# EAGLE design 2_adc (EAGLE 6.4)
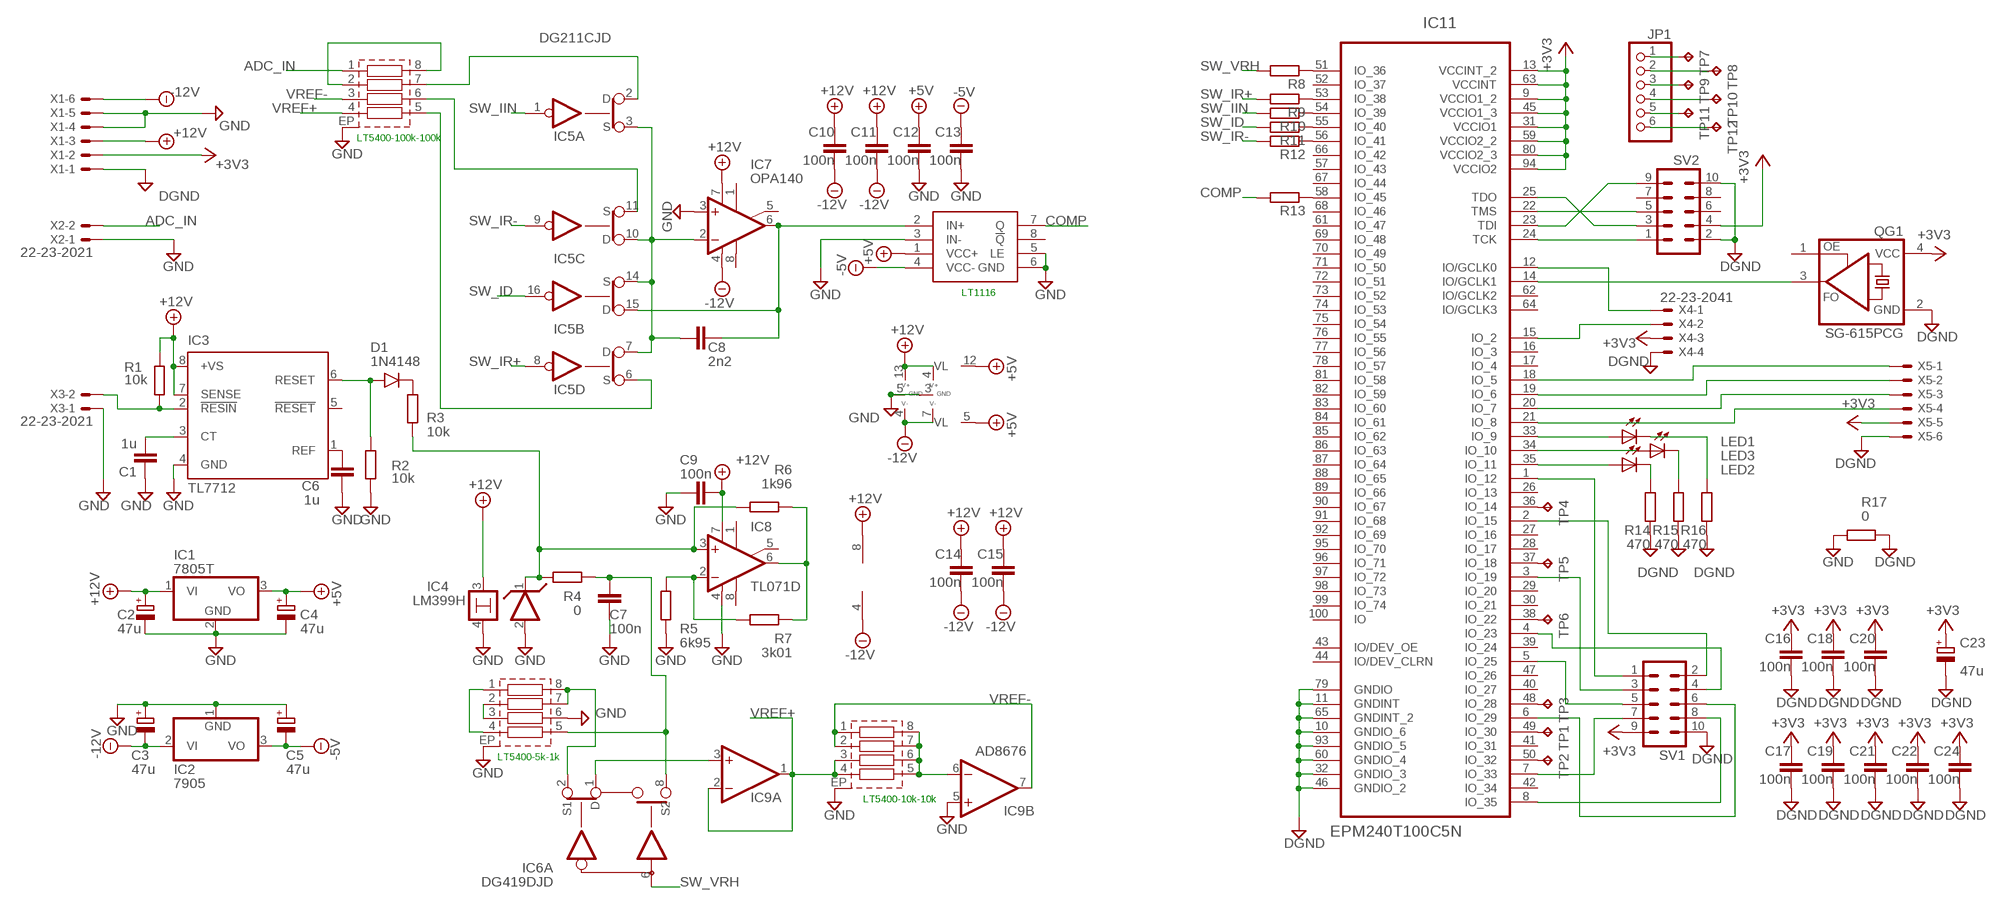
[diagram p0: schematic, sheet 1]

## Parts
C1  1u  C_0806  [R0805]
C2  47u  CPOL-EUSMCC  [SMC_C]
C3  47u  CPOL-EUSMCC  [SMC_C]
C4  47u  CPOL-EUSMCC  [SMC_C]
C5  47u  CPOL-EUSMCC  [SMC_C]
C6  1u  C_0806  [R0805]
C7  100n  C-EU050-035X075  [C050-035X075]
C8  2n2  C-EU150-054X183  [C150-054X183]
C9  100n  C_0806  [R0805]
C10  100n  C_0806  [R0805]
C11  100n  C_0806  [R0805]
C12  100n  C_0806  [R0805]
C13  100n  C_0806  [R0805]
C14  100n  C_0806  [R0805]
C15  100n  C_0806  [R0805]
C16  100n  C_0806  [R0805]
C17  100n  C_0806  [R0805]
C18  100n  C_0806  [R0805]
C19  100n  C_0806  [R0805]
C20  100n  C_0806  [R0805]
C21  100n  C_0806  [R0805]
C22  100n  C_0806  [R0805]
C23  47u  CPOL-EUSMCC  [SMC_C]
C24  100n  C_0806  [R0805]
D1  1N4148  1N4148SOD  [SOD-80]
IC1  7805T  [TO220H]
IC2  7905  7905T  [TO220H]
IC3  TL7712  TL77005AID  [SO08]
IC4  LM399H  [TO39/4]
IC5  DG211CJD  [SO16]
IC6  DG419DJD  [SO08]
IC7  OPA140  TL071D  [SO08]
IC8  TL071D  [SO08]
IC9  AD8676  TL072D  [SO08]
IC10  LT1116  [SO-08]
IC11  EPM240T100C5N  [QFP50P1600X1600X120-100N]
JP1  PINHD-1X06_2.54  [1X06]
LED1  LEDCHIPLED_0805  [CHIPLED_0805]
LED2  LEDCHIPLED_0805  [CHIPLED_0805]
LED3  LEDCHIPLED_0805  [CHIPLED_0805]
QG1  SG-615PCG  [SG-615]
R1  10k  R_0805  [R0805]
R2  10k  R_0805  [R0805]
R3  10k  R_0805  [R0805]
R4  0  R191  [R_TR191]
R5  6k95  R191  [R_TR191]
R6  1k96  R191  [R_TR191]
R7  3k01  R191  [R_TR191]
R8  R_0805  [R0805]
R9  R_0805  [R0805]
R10  R_0805  [R0805]
R11  R_0805  [R0805]
R12  R_0805  [R0805]
R13  R_0805  [R0805]
R14  470  R_0805  [R0805]
R15  470  R_0805  [R0805]
R16  470  R_0805  [R0805]
R17  0  R_0805  [R0805]
SV1  ML10  [ML10]
SV2  ML10  [ML10]
TP1  TPB1,27  [B1,27]
TP2  TPB1,27  [B1,27]
TP3  TPB1,27  [B1,27]
TP4  TPB1,27  [B1,27]
TP5  TPB1,27  [B1,27]
TP6  TPB1,27  [B1,27]
TP7  TPB1,27  [B1,27]
TP8  TPB1,27  [B1,27]
TP9  TPB1,27  [B1,27]
TP10  TPB1,27  [B1,27]
TP11  TPB1,27  [B1,27]
TP12  TPB1,27  [B1,27]
U$1  LT5400-100k-100k  LT5400  [MSOP8-EP]
U$2  LT5400-5k-1k  LT5400  [MSOP8-EP]
U$3  LT5400-10k+10k  LT5400  [MSOP8-EP]
X1  22-23-2061  [22-23-2061]
X2  22-23-2021  [22-23-2021]
X3  22-23-2021  [22-23-2021]
X4  22-23-2041  [22-23-2041]
X5  22-23-2061  [22-23-2061]

## Nets
+3V3: C16.2 C17.2 C18.2 C19.2 C20.2 C21.2 C22.2 C23.+ C24.2 IC11.9(VCCIO1_2) IC11.13(VCCINT_2) IC11.31(VCCIO1) IC11.45(VCCIO1_3) IC11.59(VCCIO2_2) IC11.63(VCCINT) IC11.80(VCCIO2_3) IC11.94(VCCIO2) QG1.4(VCC) SV1.9 SV2.4 X1.2 X4.3 X5.5
+5V: C4.+ C12.2 IC1.3(VO) IC5.12(VL:VL) IC6.5(VL:VL) IC10.1(VCC+)
+12V: C2.+ C9.2 C10.2 C11.2 C14.2 C15.2 IC1.1(VI) IC3.7(SENSE) IC3.8(+VS) IC4.3 IC5.13(P:V+) IC6.4(P:V+) IC7.7(V+) IC8.7(V+) IC9.8(P:V+) R1.2 X1.3
-5V: C5.- C13.2 IC2.3(VO) IC10.4(VCC-)
-12V: C3.- C10.1 C11.1 C14.1 C15.1 IC2.2(VI) IC5.4(P:V-) IC6.7(P:V-) IC7.4(V-) IC9.4(P:V-) X1.6
ADC_IN: U$1.1(R1A) X2.2
COMP: IC10.7(Q) R13.2
DGND: C16.1 C17.1 C18.1 C19.1 C20.1 C21.1 C22.1 C23.- C24.1 IC11.10(GNDIO_6) IC11.11(GNDINT) IC11.32(GNDIO_3) IC11.46(GNDIO_2) IC11.60(GNDIO_4) IC11.65(GNDINT_2) IC11.79(GNDIO) IC11.93(GNDIO_5) QG1.2(GND) R14.2 R15.2 R16.2 R17.2 SV1.10 SV2.2 SV2.10 X1.1 X4.4 X5.6
GND: C1.1 C2.- C3.+ C4.- C5.+ C6.1 C7.2 C9.1 C12.1 C13.1 IC1.2(GND) IC2.1(GND) IC3.4(GND) IC4.2 IC4.4 IC5.5(P:GND) IC6.3(P:GND) IC7.3(+IN) IC8.4(V-) IC9.5(B:+IN) IC10.3(IN-) IC10.5(LE) IC10.6(GND) R2.1 R5.P$1 R17.1 U$1.EP(SH) U$2.6(R3B) U$2.EP(SH) U$3.EP(SH) X1.4 X1.5 X2.1 X3.1
N$5: IC8.2(-IN) R5.P$2 R7.P$2
N$6: IC8.6(OUT) R6.P$1 R7.P$1
N$7: IC5.2(A:D) U$1.7(R2B)
N$8: C8.2 IC5.15(B:D) IC7.6(OUT) IC10.2(IN+)
N$9: IC11.53(IO_38) R9.1
N$10: C8.1 IC5.3(A:S) IC5.7(D:D) IC5.10(C:D) IC5.14(B:S) IC7.2(-IN)
N$11: U$2.1(R1A) U$2.4(R4A)
N$12: IC11.35(IO_11) LED2.A
N$13: IC11.24(TCK) SV2.1
N$14: IC11.25(TDO) SV2.3
N$15: IC6.1(A:D) IC9.3(A:+IN)
N$16: IC11.22(TMS) SV2.5
N$17: IC11.23(TDI) SV2.9
N$18: IC11.14(IO/GCLK1) QG1.3(FO)
N$19: IC5.11(C:S) U$1.6(R3B)
N$20: C6.2 IC3.1(REF)
N$21: IC11.1(IO_12) SV1.1
N$22: IC11.2(IO_15) SV1.2
N$23: IC5.6(D:S) U$1.5(R4B)
N$24: IC11.54(IO_39) R10.1
N$25: IC11.55(IO_40) R11.1
N$26: IC11.56(IO_41) R12.1
N$27: IC11.51(IO_36) R8.1
N$28: IC6.2(A:S1) U$2.7(R2B) U$2.8(R1B)
N$29: IC11.58(IO_45) R13.1
N$31: IC11.21(IO_8) X5.4
N$32: IC11.20(IO_7) X5.3
N$33: IC11.19(IO_6) X5.2
N$34: IC11.18(IO_5) X5.1
N$35: IC11.34(IO_10) LED3.A
N$36: IC11.33(IO_9) LED1.A
N$37: C1.2 IC3.3(CT)
N$38: LED2.C R14.1
N$39: LED3.C R15.1
N$40: LED1.C R16.1
N$41: IC11.49(IO_30) TP1.TP
N$42: IC11.50(IO_32) TP2.TP
N$43: IC11.48(IO_28) TP3.TP
N$44: IC11.36(IO_14) TP4.TP
N$45: IC11.37(IO_18) TP5.TP
N$46: IC11.38(IO_22) TP6.TP
N$47: JP1.1 TP7.TP
N$48: JP1.2 TP8.TP
N$49: JP1.3 TP9.TP
N$50: JP1.4 TP10.TP
N$51: JP1.5 TP11.TP
N$52: JP1.6 TP12.TP
N$53: IC11.3(IO_19) SV1.3
N$54: C7.1 IC6.8(A:S2) R4.P$1 U$2.5(R4B)
N$55: IC4.1 IC8.3(+IN) R3.1 R4.P$2 R6.P$2
N$56: IC11.4(IO_23) SV1.4
N$57: IC11.5(IO_25) SV1.5
N$58: IC11.6(IO_29) SV1.6
N$59: IC11.7(IO_33) SV1.7
N$60: IC11.8(IO_35) SV1.8
N$61: IC11.12(IO/GCLK0) X4.1
N$62: IC11.15(IO_2) X4.2
N$63: D1.A IC3.6(RESET) R2.2
N$64: D1.K R3.2
N$65: U$1.2(R2A) U$1.8(R1B)
N$66: IC9.6(B:-IN) U$3.5(R4B) U$3.6(R3B) U$3.7(R2B) U$3.8(R1B)
N$67: U$2.2(R2A) U$2.3(R3A)
N$69: IC3.2(!RESIN) R1.1 X3.2
SW_ID: IC5.16(B:IN) R11.2
SW_IIN: IC5.1(A:IN) R10.2
SW_IR+: IC5.8(D:IN) R9.2
SW_IR-: IC5.9(C:IN) R12.2
SW_VRH: IC6.6(A:IN) R8.2
VREF+: IC9.1(A:OUT) IC9.2(A:-IN) U$1.4(R4A) U$3.3(R3A) U$3.4(R4A)
VREF-: IC9.7(B:OUT) U$1.3(R3A) U$3.1(R1A) U$3.2(R2A)
Unconnected: IC3.5(!RESET) IC7.1(ON1) IC7.5(ON2) IC7.8(OPT) IC8.1(ON1) IC8.5(ON2) IC8.8(OPT) IC10.8(!Q) IC11.16(IO_3) IC11.17(IO_4) IC11.26(IO_13) IC11.27(IO_16) IC11.28(IO_17) IC11.29(IO_20) IC11.30(IO_21) IC11.39(IO_24) IC11.40(IO_27) IC11.41(IO_31) IC11.42(IO_34) IC11.43(IO/DEV_OE) IC11.44(IO/DEV_CLRN) IC11.47(IO_26) IC11.52(IO_37) IC11.57(IO_43) IC11.61(IO_47) IC11.62(IO/GCLK2) IC11.64(IO/GCLK3) IC11.66(IO_42) IC11.67(IO_44) IC11.68(IO_46) IC11.69(IO_48) IC11.70(IO_49) IC11.71(IO_50) IC11.72(IO_51) IC11.73(IO_52) IC11.74(IO_53) IC11.75(IO_54) IC11.76(IO_55) IC11.77(IO_56) IC11.78(IO_57) IC11.81(IO_58) IC11.82(IO_59) IC11.83(IO_60) IC11.84(IO_61) IC11.85(IO_62) IC11.86(IO_63) IC11.87(IO_64) IC11.88(IO_65) IC11.89(IO_66) IC11.90(IO_67) IC11.91(IO_68) IC11.92(IO_69) IC11.95(IO_70) IC11.96(IO_71) IC11.97(IO_72) IC11.98(IO_73) IC11.99(IO_74) IC11.100(IO) QG1.1(OE) SV2.6 SV2.7 SV2.8

## Notes on the sheet
- LT5400-100k-100k
- LT1116
- LT5400-5k-1k
- LT5400-10k-10k

## Library data of the parts
C1 C6 C9-C22 C24 = _moja:C
C2-C5 C23 = _rcl:CPOL-EU: POLARIZED CAPACITOR, European symbol
C7 C8 = _rcl:C-EU: CAPACITOR, European symbol
D1 = _mcom6:1N4148
IC1 = _linear:78*: Positive VOLTAGE REGULATOR Source: http://cache.national.com/ds/LM/LM78L05.pdf http://www.fairchildsemi.com/ds/LM/LM7805.pdf
IC2 = _linear:79*: Negative VOLTAGE REGULATOR
IC3 = linear:TL770*: SUPPLY VOLTAGE SUPERVISORS TL7700A Series Source: http://www.st.com/stonline/products/literature/ds/1528.pdf
IC4 = _linear:LM399H: Precision Z DIODE
IC5 = linear:DG211CJ: CMOS SWITCH
IC6 = linear:DG419DJ: CMOS SWITCH
IC7 IC8 = linear:TL071: OP AMP
IC9 = linear:TL072: OP AMP
IC10 = _mcom6:LT1116
IC11 = _moja:EPM240T100C5N: IC CPLD FLASH 192 MACROCELL; MPN: EPM240T100C5N; OC_FARNELL: 1453503; OC_NEWARK: 51R0496; PACKAGE: TQFP-100; SUPPLIER: Altera
JP1 = pinhead-2:PINHD-1X06: PIN HEADER
LED1-LED3 = led:LED: LED OSRAM: - CHIPLED LG R971, LG N971, LY N971, LG Q971, LY Q971, LO R971, LY R971 LH N974, LH R974 LS Q976, LO Q976, LY Q976 LO Q996 - Hyper CHIPLED LW Q18S LB Q993, LB Q99A, LB R99A - SideLED LS A670, LO A670, LY A670, LG A670, LP A670 LB A673, LV A673, LT A673, LW A673 LH A674 LY A675 LS A676, LA A676, LO A676, LY A676, LW A676 LS A679, LY A679, LG A679 - Hyper Micro SIDELED® LS Y876, LA Y876, LO Y876, LY Y876 LT Y87S - SmartLED LW L88C, LW L88S LB L89C, LB L89S, LG L890 LS L89K, LO L89K, LY L89K LS L896, LA L896, LO L896, LY L896 - TOPLED LS T670, LO T670, LY T670, LG T670, LP T670 LSG T670, LSP T670, LSY T670, LOP T670, LYG T670 LG T671, LOG T671, LSG T671 LB T673, LV T673, LT T673, LW T673 LH T674 LS T676, LA T676, LO T676, LY T676, LB T676, LH T676, LSB T676, LW T676 LB T67C, LV T67C, LT T67C, LS T67K, LO T67K, LY T67K, LW E67C LS E67B, LA E67B, LO E67B, LY E67B, LB E67C, LV E67C, LT E67C LW T67C LS T679, LY T679, LG T679 LS T770, LO T770, LY T770, LG T770, LP T770 LB T773, LV T773, LT T773, LW T773 LH T774 LS E675, LA E675, LY E675, LS T675 LS T776, LA T776, LO T776, LY T776, LB T776 LHGB T686 LT T68C, LB T68C - Hyper Mini TOPLED® LB M676 - Mini TOPLED Santana® LG M470 LS M47K, LO M47K, LY M47K Source: http://www.osram.convergy.de LUXEON: - LUMILED® LXK2-PW12-R00, LXK2-PW12-S00, LXK2-PW14-U00, LXK2-PW14-V00 LXK2-PM12-R00, LXK2-PM12-S00, LXK2-PM14-U00 LXK2-PE12-Q00, LXK2-PE12-R00, LXK2-PE12-S00, LXK2-PE14-T00, LXK2-PE14-U00 LXK2-PB12-K00, LXK2-PB12-L00, LXK2-PB12-M00, LXK2-PB14-N00, LXK2-PB14-P00, LXK2-PB14-Q00 LXK2-PR12-L00, LXK2-PR12-M00, LXK2-PR14-Q00, LXK2-PR14-R00 LXK2-PD12-Q00, LXK2-PD12-R00, LXK2-PD12-S00 LXK2-PH12-R00, LXK2-PH12-S00 LXK2-PL12-P00, LXK2-PL12-Q00, LXK2-PL12-R00 Source: www.luxeon.com KINGBRIGHT: KA-3528ASYC Source: www.kingbright.com
QG1 = crystal:SG-615: SOJ HIGH-FREQUENCY CRYSTAL OSCILLATOR Source: Crystal Oscillator SG-615%20Series.pdf
R1-R17 = _moja:R
SV1 SV2 = con-harting-ml:ML10: HARTING
TP1-TP12 = testpad:TP: Test pad
U$1-U$3 = _mcom6:LT5400
X1 X5 = con-molex:22-23-2061: .100" (2.54mm) Center Header - 6 Pin; MF: MOLEX; MPN: 22-23-2061; OC_FARNELL: 1462922; OC_NEWARK: 27C1933
X2 X3 = con-molex:22-23-2021: .100" (2.54mm) Center Header - 2 Pin; MF: MOLEX; MPN: 22-23-2021; OC_FARNELL: 1462926; OC_NEWARK: 25C3832
X4 = con-molex:22-23-2041: .100" (2.54mm) Center Header - 4 Pin; MF: MOLEX; MPN: 22-23-2041; OC_FARNELL: 1462920; OC_NEWARK: 38C0355

## Board
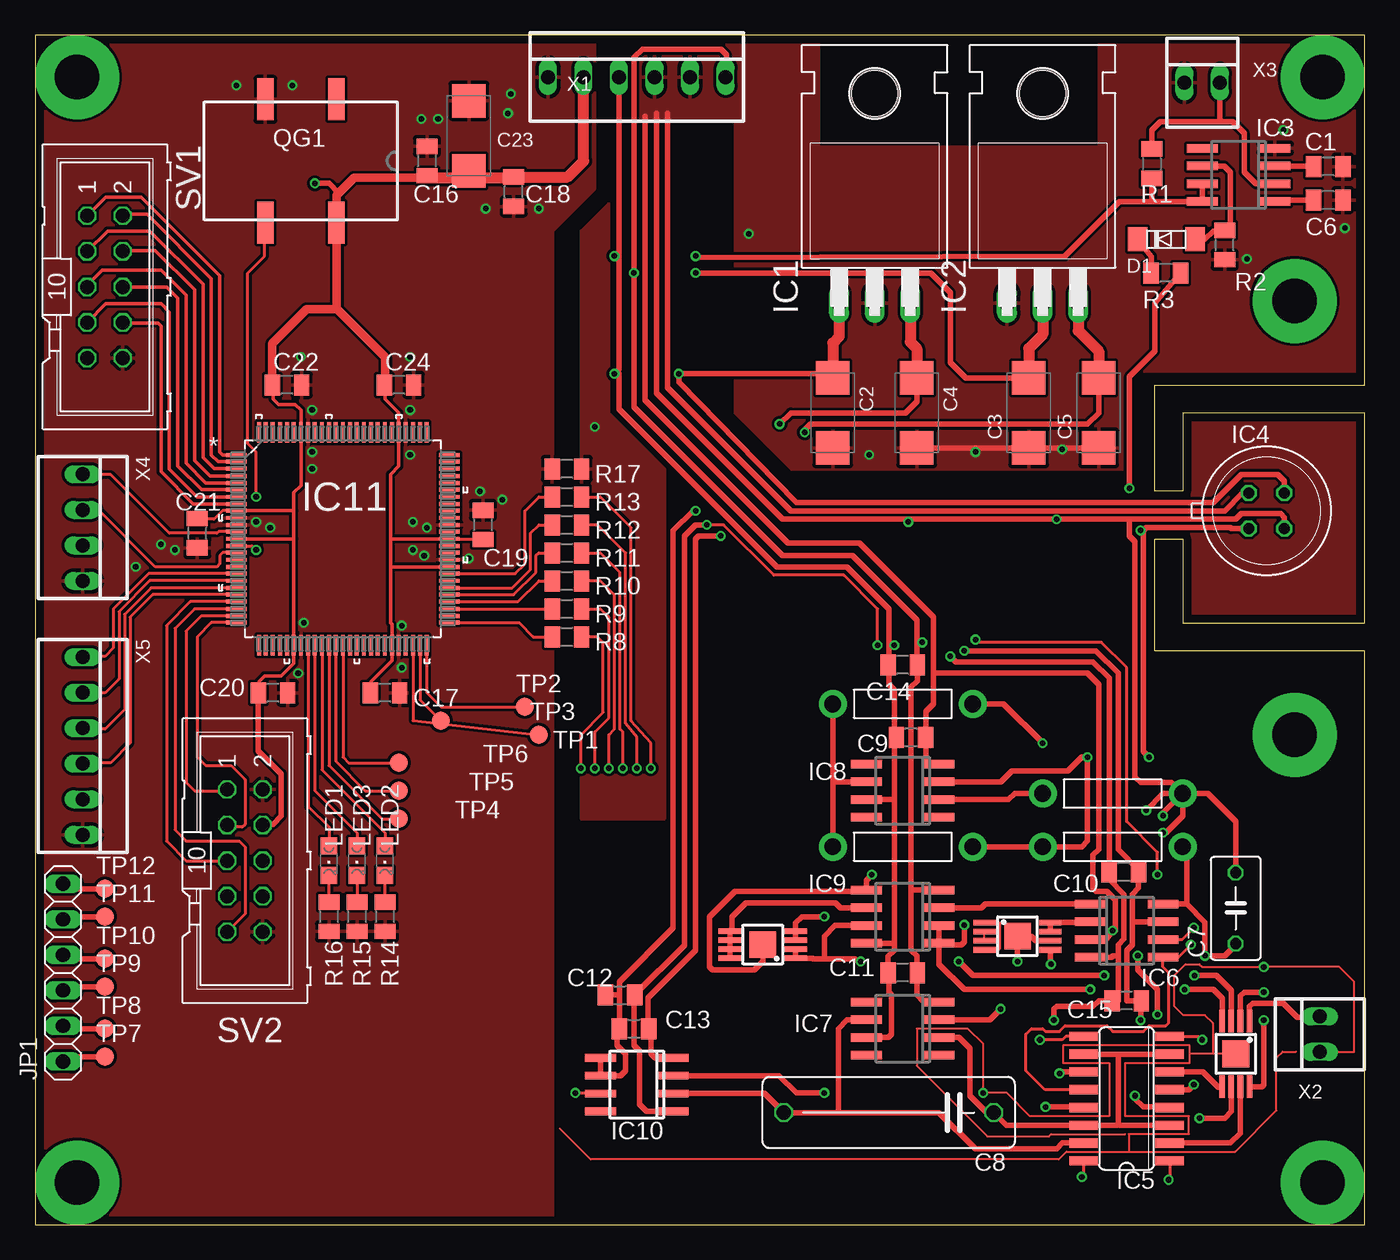
[diagram p1: board, top side]
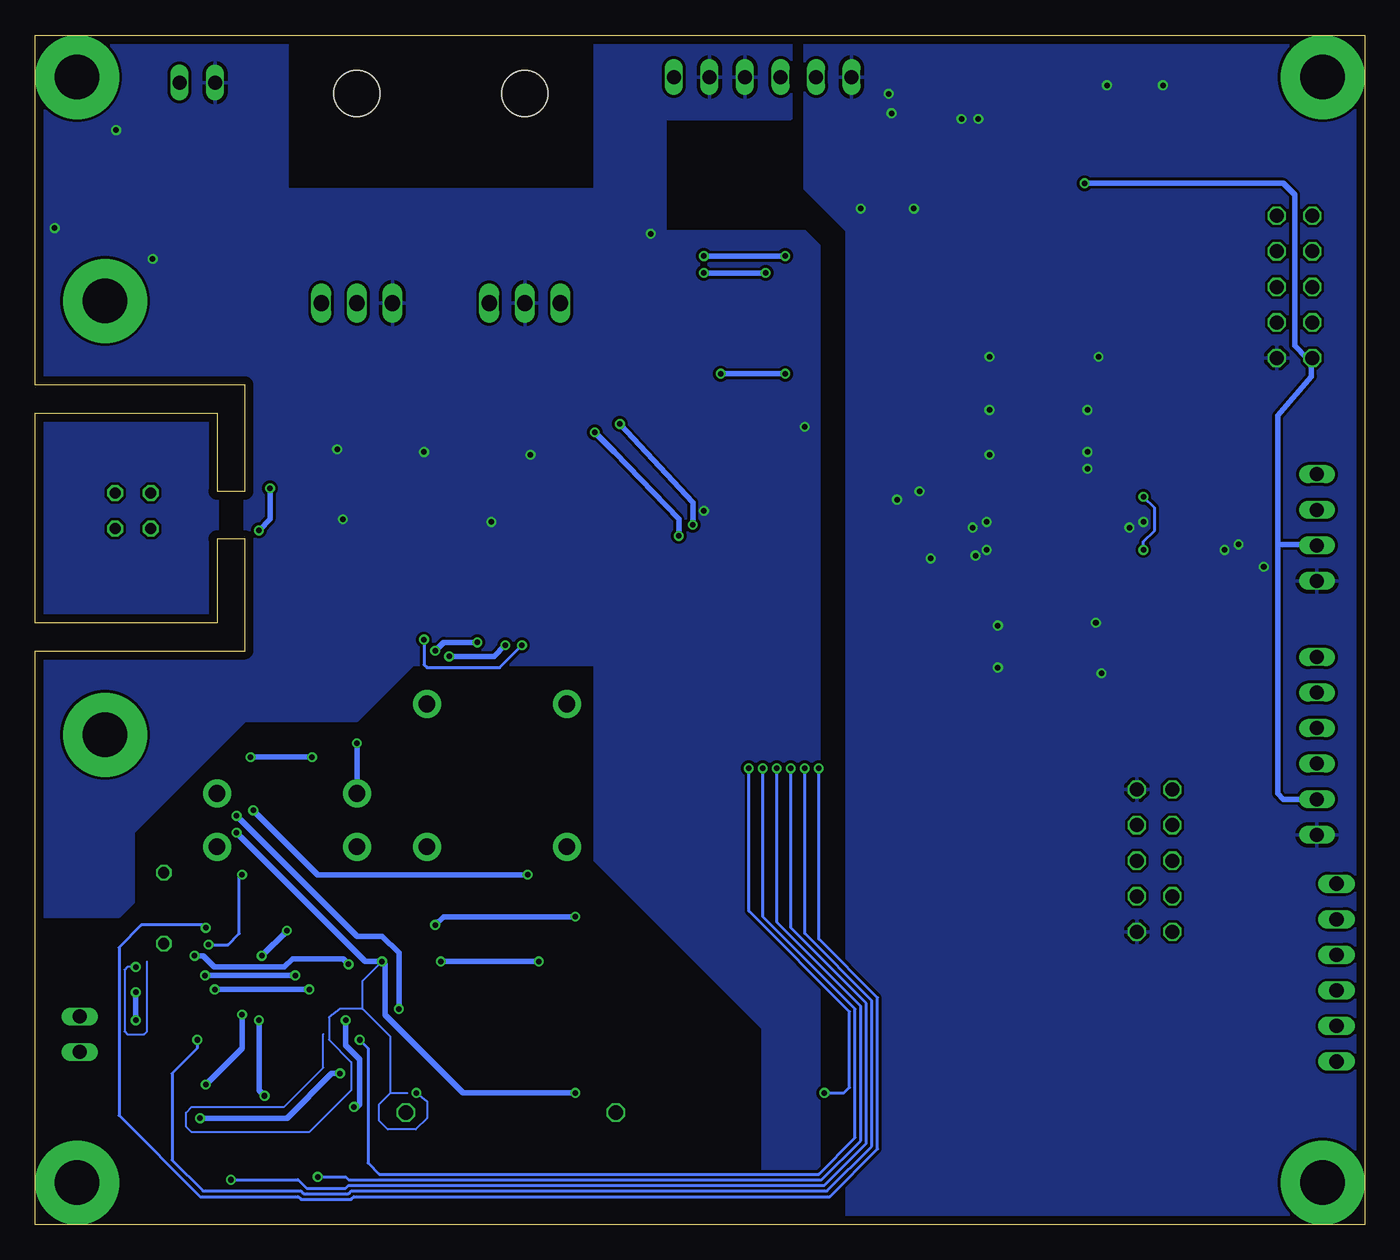
[diagram p2: board, bottom side, seen from below]

Size 95 x 85 mm. Coordinates in mm from the lower left corner, seen from the top.
Outline: 0,0 95,0 95,41 80,41 80,49 82,49 82,43 95,43 95,58 82,58 82,52.4 80,52.4 80,60 95,60 95,85 0,85 0,0
Copper layers (1*16): Top 0.035mm / dielectric 1.5mm / Bottom 0.035mm
Design rules "ch_6": minimum track width 0.15mm, minimum drill 0.4mm, track to track 0.2mm, track to pad 0.2mm, pad to pad 0.2mm, via to via 0.2mm, smd to smd 0.2mm, copper to edge 0.6mm, drill to drill 8mil, minimum pad ring 0.15mm, minimum via ring 0.15mm, stop-mask expansion 4mil, vias tented up to drill 0mil, thermal gap 10mil

### Footprints (pad centres in the part's own frame; a part is rotated, then mirrored left to right if it is on the bottom)
R0805 = smd 1.1 x 1.5: 1 -1.05,0; 2 1.05,0
SMC_C = smd 2.4 x 2.4: + -2.5,0; - 2.5,0
C050-035X075 = drill 0.813 octagon: 1 -2.54,0; 2 2.54,0
C150-054X183 = drill 1.016 octagon: 1 -7.493,0; 2 7.493,0
SOD-80 = smd 1.397 x 1.702: A 1.905,0; K -2.223,0
TO220H = drill 1.118 long: 1 -2.54,-10.16; 2 0,-10.16; 3 2.54,-10.16 | hole 3.302: 0,4.826
SO08 = smd 0.6 x 2.2: 1 -1.905,-2.6; 2 -0.635,-2.6; 3 0.635,-2.6; 4 1.905,-2.6; 5 1.905,2.6; 6 0.635,2.6; 7 -0.635,2.6; 8 -1.905,2.6
TO39/4 = drill 0.813 octagon: 1 -1.27,-1.27; 2 1.27,-1.27; 3 1.27,1.27; 4 -1.27,1.27
SO16 = smd 0.66 x 2.032: 1 -4.445,-3.073; 2 -3.175,-3.073; 3 -1.905,-3.073; 4 -0.635,-3.073; 5 0.635,-3.073; 6 1.905,-3.073; 7 3.175,-3.073; 8 4.445,-3.073; 9 4.445,3.073; 10 3.175,3.073; 11 1.905,3.073; 12 0.635,3.073; 13 -0.635,3.073; 14 -1.905,3.073; 15 -3.175,3.073; 16 -4.445,3.073
SO-08 = smd 0.55 x 2.2: 1 -1.905,-2.6; 2 -0.635,-2.6; 3 0.635,-2.6; 4 1.905,-2.6; 5 1.905,2.6; 6 0.635,2.6; 7 -0.635,2.6; 8 -1.905,2.6
QFP50P1600X1600X120-100N = smd 1.473 x 0.279: 1 -7.62,5.994; 2 -7.62,5.512; 3 -7.62,5.004; 4 -7.62,4.496; 5 -7.62,3.988; 6 -7.62,3.505; 7 -7.62,2.997; 8 -7.62,2.489; 9 -7.62,2.007; 10 -7.62,1.499; 11 -7.62,0.991; 12 -7.62,0.508; 13 -7.62,0; 14 -7.62,-0.508; 15 -7.62,-0.991; 16 -7.62,-1.499; 17 -7.62,-2.007; 18 -7.62,-2.489; 19 -7.62,-2.997; 20 -7.62,-3.505; 21 -7.62,-3.988; 22 -7.62,-4.496; 23 -7.62,-5.004; 24 -7.62,-5.512; 25 -7.62,-5.994; 51 7.62,-5.994; 52 7.62,-5.512; 53 7.62,-5.004; 54 7.62,-4.496; 55 7.62,-3.988; 56 7.62,-3.505; 57 7.62,-2.997; 58 7.62,-2.489; 59 7.62,-2.007; 60 7.62,-1.499; 61 7.62,-0.991; 62 7.62,-0.508; 63 7.62,0; 64 7.62,0.508; 65 7.62,0.991; 66 7.62,1.499; 67 7.62,2.007; 68 7.62,2.489; 69 7.62,2.997; 70 7.62,3.505; 71 7.62,3.988; 72 7.62,4.496; 73 7.62,5.004; 74 7.62,5.512; 75 7.62,5.994 | smd 0.279 x 1.473: 26 -5.994,-7.62; 27 -5.512,-7.62; 28 -5.004,-7.62; 29 -4.496,-7.62; 30 -3.988,-7.62; 31 -3.505,-7.62; 32 -2.997,-7.62; 33 -2.489,-7.62; 34 -2.007,-7.62; 35 -1.499,-7.62; 36 -0.991,-7.62; 37 -0.508,-7.62; 38 0,-7.62; 39 0.508,-7.62; 40 0.991,-7.62; 41 1.499,-7.62; 42 2.007,-7.62; 43 2.489,-7.62; 44 2.997,-7.62; 45 3.505,-7.62; 46 3.988,-7.62; 47 4.496,-7.62; 48 5.004,-7.62; 49 5.512,-7.62; 50 5.994,-7.62; 76 5.994,7.62; 77 5.512,7.62; 78 5.004,7.62; 79 4.496,7.62; 80 3.988,7.62; 81 3.505,7.62; 82 2.997,7.62; 83 2.489,7.62; 84 2.007,7.62; 85 1.499,7.62; 86 0.991,7.62; 87 0.508,7.62; 88 0,7.62; 89 -0.508,7.62; 90 -0.991,7.62; 91 -1.499,7.62; 92 -2.007,7.62; 93 -2.489,7.62; 94 -2.997,7.62; 95 -3.505,7.62; 96 -3.988,7.62; 97 -4.496,7.62; 98 -5.004,7.62; 99 -5.512,7.62; 100 -5.994,7.62
1X06 = drill 1.016 long: 1 -6.35,0; 2 -3.81,0; 3 -1.27,0; 4 1.27,0; 5 3.81,0; 6 6.35,0
CHIPLED_0805 = smd 1.2 x 1.2: A 0,-1.05; C 0,1.05
SG-615 = smd 1.2 x 3: 1 -2.54,-4.4; 2 2.54,-4.4; 3 2.54,4.4; 4 -2.54,4.4
R_TR191 = drill 1.2 pad 2: P$1 5,0; P$2 -5,0
ML10 = drill 1 octagon: 1 -5.08,-1.27; 2 -5.08,1.27; 3 -2.54,-1.27; 4 -2.54,1.27; 5 0,-1.27; 6 0,1.27; 7 2.54,-1.27; 8 2.54,1.27; 9 5.08,-1.27; 10 5.08,1.27
B1,27 = smd 1.27 x 1.27: TP 0,0
MSOP8-EP = smd 0.4 x 1.6: 1 -0.975,-2.35; 2 -0.325,-2.35; 3 0.325,-2.35; 4 0.975,-2.35; 5 0.975,2.35; 6 0.325,2.35; 7 -0.325,2.35; 8 -0.975,2.35 | smd 1.9 x 1.9: EP 0,0
22-23-2061 = drill 1 long: 1 -6.35,0; 2 -3.81,0; 3 -1.27,0; 4 1.27,0; 5 3.81,0; 6 6.35,0
22-23-2021 = drill 1 long: 1 -1.27,0; 2 1.27,0
22-23-2041 = drill 1 long: 1 -3.81,0; 2 -1.27,0; 3 1.27,0; 4 3.81,0

### Placement (x,y rotation side)
C1  92.4,75.6 180 top
C2  57,58 270 top
C3  71,58 90 top
C4  63,58 270 top
C5  76,58 90 top
C6  92.4,73.2 180 top
C7  85.8,22.6 90 top
C8  61,8 180 top
C9  62.6,34.8 180 top
C10  77.8,25.2 180 top
C11  62,18 180 top
C12  41.8,16.4 0 top
C13  42.8,14 0 top
C14  62,40 180 top
C15  78,16 180 top
C16  28,76 270 top
C17  25,38 180 top
C18  34.2,73.8 90 top
C19  32,50 270 top
C20  17,38 180 top
C21  11.6,49.4 90 top
C22  18,60 180 top
C23  31,77.8 90 top
C24  26,60 180 top
D1  81,70.4 0 top
IC1  60,76 0 top
IC2  72,76 0 top
IC3  86,75 90 top
IC4  88,51 0 top
IC5  78,9 90 top
IC6  78,21 270 top
IC7  62,14 90 top
IC8  62,31 90 top
IC9  62,22 90 top
IC10  43,10 90 top
IC11  22,49 0 top
JP1  2,18 90 top
LED1  21,26 180 top
LED2  25,26 180 top
LED3  23,26 180 top
QG1  19,76 180 top
R1  79.8,75.8 270 top
R2  85,70 90 top
R3  80.8,68 180 top
R4  77,27 0 top
R5  77,30.8 0 top
R6  62,27 180 top
R7  62,37.2 180 top
R8  38,42 0 top
R9  38,44 0 top
R10  38,46 0 top
R11  38,48 0 top
R12  38,50 0 top
R13  38,52 0 top
R14  25,22 270 top
R15  23,22 270 top
R16  21,22 270 top
R17  38,54 180 top
SV1  5,67 270 top
SV2  15,26 270 top
TP1  29,36 0 top
TP2  35,37 0 top
TP3  36,35 0 top
TP4  26,29 0 top
TP5  26,31 0 top
TP6  26,33 0 top
TP7  5,12 0 top
TP8  5,14 0 top
TP9  5,17 0 top
TP10  5,19 0 top
TP11  5,22 0 top
TP12  5,24 0 top
U$1  85.8,12.2 180 top
U$2  70.2,20.6 270 top
U$3  52,20 90 top
X1  43,82 0 top
X2  91.8,13.6 90 top
X3  83.4,81.6 0 top
X4  3.4,49.8 270 top
X5  3.4,34.2 270 top

### Tracks (layer width: path | path; a pad name or v marks a point on that pad's centre or on a via)
+3V3  (via drill 0.4)
  Top 0.2: IC11.9 13.41,51.01 12.8,50.4 11.65,50.4 C21.2 | IC11.63 31.95,49 C19.2
  Top 0.25: C22.2 17,59.95 17,59 17.4,58.6 18.6,58.6 19,58.2 IC11.94 19,52.8 18.5,52.3 18.5,51 | C24.2 25,59.95 25,59 25.99,58.01 IC11.80 25.99,54.19 25.4,53.6 25.4,49 | C20.2 16,38.05 16,38.8 16.4,39.2 17.6,39.2 18.5,40.09 IC11.31 18.5,49 | C17.2 24,38.05 24,38.8 25.5,40.3 IC11.45 25.5,42.9 25.4,43 25.4,47 | 18.5,49 18.5,51 | IC11.9 18.49,51.01 18.5,51 | IC11.13 18.5,49 | 25.4,47 25.4,49 | IC11.63 25.4,49 | IC11.59 25.41,46.99 25.4,47
  Top 0.4: v20,74.4 21,74.4 21.7,73.7 | C20.2 15.95,33.85 17.6,32.2 17.6,29.2 17,28.6 16.33,28.6 SV2.4
  Top 0.6: 28.15,74.8 C16.2 27.85,74.8 22.8,74.8 21.7,73.7 21.54,73.54 QG1.4 21.54,65.46 | 21.54,65.46 25,62 25,60.05 C24.2 | C22.2 16.95,62.95 19.4,65.4 21.48,65.4 21.54,65.46
  Top 0.8: 28.15,74.8 31,74.8 | 31,74.8 34.15,74.8 C18.2 38.05,74.85 39.2,76 X1.2 | C23.+ 31,74.8
  Bottom 0.4: v20,74.4 5.8,74.4 5,73.6 5,62.8 4.12,61.92 SV1.9 3.8,61.85 3.8,60.6 6.2,57.8 6.2,48.6 | 6.2,48.6 6.2,30.8 5.79,30.39 X5.5 | X4.3 3.53,48.53 3.6,48.6 6.2,48.6
+5V  (via drill 0.4)
  Top 0.2: v82.6,20 81.69,19.09 IC6.5 80.6,18.4 81,18 81,14.4 80.8,14.2 79.6,14.2 79.2,13.8 77,13.8 76.6,14.2 73.6,14.2 73.2,13.8 72.2,13.8 72,14 71.2,14 70.8,13.6 70.8,11 72.17,9.63 IC5.12 | v80.2,25 80.2,26.6 78,28.8 78,39.8 76.2,41.6 67.4,41.6 v67.2,41.8 | v60.2,41.4 60.2,44 57.8,46.4 52.8,46.4 49.2,50 v48,50
  Top 0.4: IC10.1 43.7,8.1 43.2,8.6 43.2,12.4 42.8,12.8 42.8,16.35 C12.2 46.4,19.95 46.4,49.2 47.2,50 v48,50 | v53.2,57.2 54,58 62.2,58 63,58.8 C4.+
  Top 0.8: IC1.3 62.54,63.06 63,62.6 C4.+
  Bottom 0.2: v82.6,20 81.2,20 80.4,20.8 80.4,24.8 v80.2,25 | v67.2,41.8 67.2,40 67,39.8 61.8,39.8 v60.2,41.4
  Bottom 0.4: v48,50 48,51.6 v53.2,57.2
+12V  (via drill 0.4)
  Top 0.4: 61,41.4 61,44 58,47 53,47 41.73,58.27 41.73,60.8 v41.4,60.8 41.73,61.13 41.73,69.2 | 61,41.4 61,40.05 C14.2 61,39.95 61,38.6 61.4,38.2 61.4,34.8 | IC7.7 60.97,13.37 61.2,13.6 61.2,16.4 61,16.6 61,17.95 C11.2 60.95,19.15 61.4,19.6 61.4,20.2 | 61.4,20.2 61.4,30.4 | 61.4,30.4 61.4,34.8 | IC8.7 61.37,30.36 61.4,30.4 | IC9.8 61.3,20.09 61.4,20.2 | C9.2 61.4,34.8 | 77.4,19.2 77.4,20 77.8,20.4 77.8,23.6 76.75,24.65 C10.2 76.75,39.05 75.6,40.2 65.8,40.2 v65.4,40.6 | 77.4,19.2 77.4,16 C15.2 76,16 75.6,15.6 73,15.6 72.8,15.4 v72.8,14.6 | IC5.13 74.96,8.4 v72.2,8.4 | IC6.4 76.89,19.09 77,19.2 77.4,19.2 | IC4.3 89.27,53.13 88.8,53.6 86.2,53.6 84.2,51.6 54.4,51.6 46,60.2 v46,60.8 56.7,60.8 C2.+ | v61.4,41.4 61,41.4 | IC3.7 IC3.8 79.8,73.09 | X1.3 41.73,69.2 | 79.8,73.09 77.5,73.09 73.6,69.2 47.3,69.09 v47.2,69.2 | v41.4,69.2 41.73,69.2 | R1.2 79.8,73.09
  Top 0.8: IC1.1 57.46,63.46 57,63 57,61.2 56.8,61 56.8,60.7 C2.+
  Bottom 0.4: v72.2,8.4 72,8.4 71.8,8.6 71.8,11.8 72.8,12.8 v72.8,14.6 | v65.4,40.6 62.2,40.6 v61.4,41.4 | v46,60.8 v41.4,60.8 | v47.2,69.2 v41.4,69.2
-5V  (via drill 0.4)
  Top 0.4: IC10.4 44.3,11.9 44,12.2 44,13.85 C13.2 43.8,14.05 43.8,16.2 47.2,19.6 47.2,49 47.4,49.2 v49,49.2 | v55,56.6 55,56.8 55.4,57.2 75.2,57.2 76,58 C5.-
  Top 0.8: IC2.3 74.54,63.86 76,62.4 C5.-
  Bottom 0.4: v49,49.2 49,50.4 53.6,55.2 v55,56.6
-12V  (via drill 0.4)
  Top 0.4: 63,41.6 63,43.2 58.4,47.8 53.4,47.8 42.8,58.4 v42.8,68 42.8,83.4 43.4,84 49,84 49.4,83.6 49.4,82.05 X1.6 | 63,41.6 63,40.05 C14.1 63.05,38.85 62.6,38.4 62.6,24 | 62.6,24 62.6,19.6 63,19.2 63,18.05 C11.1 63,17.95 63,16.4 63.49,15.9 IC7.4 | v66.4,41 75.8,41 77.4,39.4 77.4,26.8 78.85,25.35 C10.1 78.85,24.05 78.4,23.6 78.4,21.6 | 78.4,21.6 78.4,20 78,19.6 78,16 C15.1 79,15.95 v79,14.6 | IC5.4 81.04,8.4 79.2,8.4 78.6,9 v78.6,9.2 | IC6.7 78.44,21.64 78.4,21.6 | IC9.4 62.7,23.91 62.6,24 | v63.4,41.6 63,41.6 | C3.- 66.5,60.5 65.4,61.6 65.4,66.6 64,68 v47.2,68
  Top 0.8: IC2.2 72,63.6 71,62.6 C3.-
  Bottom 0.4: v78.6,9.2 79,9.6 v79,14.6 | v66.4,41 65.8,41.6 v63.4,41.6 | v47.2,68 v42.8,68
ADC_IN
  Top 0.4: U$1.1 86.78,15.57 87,15.8 89.2,15.8 90.2,14.8 91.8,14.8 X2.2
COMP  (via drill 0.4)
  Top 0.2: IC10.7 38.84,9.37 v38.6,9.4 | v44,32.6 44,34.4 42.6,36 42.6,49.8 40.4,52 R13.2
  Bottom 0.2: v38.6,9.4 37.2,9.4 36.8,9.8 36.8,15.2 44,22.4 v44,32.6
DGND  (via drill 0.4)
  other vias: 19.8,55.2 19.8,58.2 26.8,58.2 26.8,55 15.8,50.2 10,48.2 7.2,47 19.2,43 18.8,39.4 26.2,39.8 26.2,42.8 27,48.2 27.8,47.8 31,47.6 27,50.2 28,49.8 33.4,51.8 9,48.6 16.8,49.8 19.8,54 19,62 26.8,62 31.8,52.4 27.6,79 28.8,79 34,80.8 33.8,79.4 32.2,72.6 36,72.6 14.4,81.4 18.4,81.4
  pour Top: 0,85 0,0 37,0 37,71 40,74 40,85
  pour Bottom: 0,0 37,0 37,71 40,74 40,85 0,85
GND  (via drill 0.4)
  Top 0.16: 82.5,12.2 82.5,11.55 77.9,11.55 77.9,7.75 82.45,7.75 82.45,6.45 78.15,6.45 78.15,5.2 | 82.5,12.2 82.5,12.8 73.45,12.8 73.45,11.55 76.75,11.55 76.75,7.75 71.1,7.75 69.45,9.4 v67.75,9.4 67.75,12.9 66.65,14 63,14 63,11.35 68.05,6.3 72.45,6.3 72.6,6.45 77.9,6.45 | U$1.EP 84.15,12.2 | 84.15,12.2 82.5,12.2 | 94.23,12.33 94.25,12.35 | 94.25,12.35 94.25,17.35 93.2,18.4 v87.8,18.4 83.4,18.4 83.2,18.6 82.2,18.6 81.4,17.8 81.4,15.6 82.05,14.95 83.6,14.95 84.15,14.4 84.15,12.2 | 78.15,5.2 73.7,5.2 73.15,4.65 39.7,4.65 37.5,6.85 | 78.15,5.2 85.75,5.2 88.7,8.15 88.7,11.9 89.15,12.35 90.1,12.35 | X2.1 94.25,12.33 94.25,12.35
  Top 0.4: IC6.3 75.36,20.4 76.6,20.4 v77,21 77.2,21 77.2,23.2 76.6,23.8 75.8,23.8 75.6,24 75.6,26.4 76,26.8 76,38.6 75.2,39.4 64.2,39.4 | 70.53,20.27 U$2.EP | U$2.6 71.53,20.27 71.2,20.6 U$2.EP | U$2.EP v70.2,18.8 | C7.2 85.8,28.8 83.8,30.8 R5.P$1 | IC4.2 89.27,50.53 89,50.8 86.2,50.8 85.8,50.4 78.2,50.4 | 78.2,50.4 78.2,49.2 78.6,48.8 78.6,32 79,31.6 81.2,31.6 R5.P$1 | 64.2,39.4 64.2,37.2 63.65,36.65 C9.1 63.65,32.95 63.8,32.8 64.5,32.8 IC8.4 | 64.2,39.4 64.2,43.4 58.9,48.7 53.8,48.7 43.6,58.9 43.6,79.2 | IC4.4 86.27,52.27 85,51 54,51 45.2,59.8 45.2,79.4 | 78.2,50.4 53.4,50.4 44.4,59.4 44.4,79.4 | v59.8,25 59.4,24.6 IC9.5 58.6,23.8 50,23.8 48.2,22 48.2,18.4 48.4,18.2 51.4,18.2 52,18.8 U$3.EP | IC5.5 82.44,9.63 v82.8,10 | v80.2,15 80.2,16.8 78.8,18.2 v78.8,19.2 | IC7.3 68.23,14.63 v69,15.4 | v79.4,29.6 80.6,30.8 R5.P$1 | v80.6,29.2 80.6,29.4 R5.P$1 | v80.6,28 80.8,28 82,29.2 R5.P$1 | 41.75,16.4 C13.1 41.6,13.85 41.6,12.8 42.2,12.2 42.2,11 41.84,10.63 IC10.6 IC10.5 | 41.75,16.4 41.75,17.35 45.6,21.2 45.6,49.6 47,51 v47.2,51 | C12.1 41.75,16.4 | IC10.3 53.16,10.63 54.4,9.4 v56.4,9.4 | 56.9,55.6 C2.- | C4.- C3.+ C5.+
  Bottom 0.16: v67.75,9.4 67,8.8 67,7.6 67.8,6.8 69.8,6.8 70.4,7.4 70.4,8.6 69.6,9.4 | 69.6,9.4 69.6,13.4 71.6,15.4 | 71.6,15.4 73.2,15.4 74,14.8 74,13.2 72.4,11.6 72.4,9.6 75.4,6.6 83.8,6.6 84.2,7 84.2,8 83.8,8.4 77.2,8.4 74.4,11.2 74.4,13.6 | 69.6,9.4 68.4,9.4 | 71.6,15.4 71.6,17.4 v70.2,18.8 | v87.8,18.4 88.4,18.4 88.6,18.2 88.6,13.8 88.4,13.6 87.2,13.6 87,13.8 87,18.8
  Bottom 0.4: v59.8,25 74.8,25 v79.4,29.6 | v78.8,19.2 v77,21 | v69,15.4 69,19.4 U$2.EP 72,20.6 v80.6,29.2 | v80.6,28 71.4,18.8 v70.2,18.8 70,18.6 70,15 64.4,9.4 v56.4,9.4 | v80.2,15 80.2,12.6 v82.8,10
  other vias: 40,57 59.6,55 67.2,55.2 73.4,55.4 62.4,50.2 73,50.4 86.6,69 93.6,71.2 89.2,78.2 51,70.8
  pour Top: 41,85 41,79 50,79 50,58 54,54 79,54 79,61 95,61 95,85 76,85 76,77 56,77 56,85
  pour Bottom: 41,85 41,79 50,79 50,71 40,71 39,70 39,0 43,0 43,14 55,26 55,40 68,40 72,36 80,36 88,28 88,23 89,22 95,22 95,41 80,41 80,60 95,60 95,85 77,85 77,74 55,74 55,85
  pour Top: 39,71 39,29 45,29 45,54 41,58 41,73
N$1  (via drill 3.2 pad 6)
  other vias: 3,82
N$2  (via drill 3.2 pad 6)
  other vias: 92,82
N$3  (via drill 3.2 pad 6)
  other vias: 3,3
N$4  (via drill 3.2 pad 6)
  other vias: 92,3
N$5  (via drill 0.4)
  Top 0.4: IC8.2 69.56,30.36 70,30.8 R5.P$2 | R7.P$2 69.2,37.2 v72,34.4
  Bottom 0.4: v72,34.4 R5.P$2
N$6
  Top 0.4: R7.P$1 57,31.8 | 57,31.8 R6.P$1 | IC8.6 57.16,31.64 57,31.8
N$7
  Top 0.4: U$1.7 86.12,6.53 85.42,5.83 IC5.2
N$8
  Top 0.4: 57.4,8 64.6,8 67.2,5.4 73,5.4 73.42,5.83 IC5.15 | 57.4,8 C8.2 52.14,9.37 IC10.2 | IC7.6 58.03,14.63 57.4,14 57.4,8
N$9
  Top 0.2: IC11.53 R9.1
N$10
  Top 0.4: IC5.7 77.4,12.18 | 77.4,12.18 IC5.10 | 77.4,7.2 77.3,7.09 IC5.14 69.4,7.09 C8.1 68,8 66.8,9.2 66.8,12.6 66.03,13.37 IC7.2 | 77.4,7.2 77.4,12.18 | IC5.3 77.5,7.09 77.4,7.2
N$11
  Top 0.16: U$2.1 68.88,21.57 68.95,21.5 68.95,19.7 68.85,19.6 67.88,19.6 U$2.4
N$12
  Top 0.2: IC11.35 20.5,32.5 25,28 LED2.A
N$13
  Top 0.2: IC11.24 11.89,43.49 10.8,42.4 10.8,31.6 11.4,31 13.65,31 SV2.1
N$14
  Top 0.2: IC11.25 12.61,43.01 11.6,42 11.6,33.4 12.2,32.8 14,32.8 15,31.8 15,28.6 14.8,28.4 13.87,28.4 SV2.3
N$15
  Top 0.4: IC6.1 67.91,22.91 67.64,22.64 IC9.3
N$16
  Top 0.2: IC11.22 11.1,44.5 9.4,42.8 9.4,27.4 10.8,26 SV2.5
N$17
  Top 0.2: IC11.23 11.4,44 10,42.6 10,28.2 10.8,27.4 14.6,27.4 15,27 15,22.19 SV2.9
N$18  (via drill 0.4)
  Top 0.2: IC11.14 15.51,48.49 v15.8,48.2 | v15.8,52 15.8,55.2 15.2,55.8 15.2,68 16.4,69.2 16.4,71.54 QG1.3
  Bottom 0.2: v15.8,48.2 15.8,48.8 15,49.6 15,51.2 v15.8,52
N$19  (via drill 0.4)
  Top 0.4: U$1.6 85.47,8.07 85,7.6 v83.2,7.6 | IC5.11 73.11,10.9 v73.2,10.8
  Bottom 0.4: v83.2,7.6 77,7.6 73.8,10.8 v73.2,10.8
N$20
  Top 0.4: C6.2 88.6,73.2 IC3.1
N$21
  Top 0.25: IC11.1 13.41,54.99 13.2,55.2 13.2,67.8 7.6,73.4 5.05,73.4 SV1.1
N$22
  Top 0.25: IC11.2 13.09,54.51 12.6,55 12.6,67.6 8,72.2 6.39,72.2 SV1.2
N$23
  Top 0.4: IC5.6 83.44,10.9 84.55,9.8 84.78,9.8 U$1.5
N$24
  Top 0.2: IC11.54 34.5,44.5 36,46 R10.1
N$25
  Top 0.2: IC11.55 34.21,45.01 35.8,46.6 35.8,47.8 36,48 R11.1
N$26
  Top 0.2: IC11.56 34.09,45.49 35.4,46.8 35.4,49.4 36,50 R12.1
N$27
  Top 0.2: IC11.51 34.59,43.01 35.6,42 R8.1
N$28
  Top 0.4: IC6.2 75.36,21.6 73.8,21.6 73.78,21.57 U$2.8 U$2.7
N$29
  Top 0.2: IC11.58 34.31,46.51 35,47.2 35,51 36,52 R13.1
N$30  (via drill 3.2 pad 6)
  other vias: 90,66
N$31
  Top 0.2: IC11.21 8.41,45.01 6.8,43.4 6.8,34.4 5.4,33 3.47,33 X5.4
N$32
  Top 0.2: IC11.20 8.29,45.49 6.4,43.6 6.4,36.8 5,35.4 3.47,35.4 X5.3
N$33
  Top 0.2: IC11.19 8.2,46 6,43.8 6,39 5,38 X5.2
N$34
  Top 0.2: IC11.18 8.11,46.51 5.6,44 5.6,41.2 5,40.6 3.45,40.6 X5.1
N$35
  Top 0.2: IC11.34 19.99,31.01 23,28 LED3.A
N$36
  Top 0.2: IC11.33 19.51,29.89 21,28.4 LED1.A
N$37
  Top 0.4: IC3.3 91.35,75.64 C1.2
N$38
  Top 0.2: R14.1 LED2.C
N$39
  Top 0.2: LED3.C R15.1
N$40
  Top 0.2: R16.1 LED1.C
N$41
  Top 0.2: IC11.49 27.51,37.49 TP1.TP
N$42
  Top 0.2: IC11.50 27.99,38.01 29,37 TP2.TP
N$43
  Top 0.2: IC11.48 27,36 TP3.TP
N$44
  Top 0.2: IC11.36 21.01,32.79 24.8,29 TP4.TP
N$45
  Top 0.2: IC11.37 21.49,33.11 23.6,31 TP5.TP
N$46
  Top 0.2: IC11.38 22,33.4 22.4,33 TP6.TP
N$47
  Top 0.4: TP7.TP 2.35,12 JP1.1
N$48
  Top 0.4: TP8.TP 2.19,14 JP1.2
N$49
  Top 0.4: TP9.TP 2.27,17 JP1.3
N$50
  Top 0.4: TP10.TP 2.27,19 JP1.4
N$51
  Top 0.4: TP11.TP 2.19,22 JP1.5
N$52
  Top 0.4: TP12.TP 2.35,24 JP1.6
N$53
  Top 0.25: IC11.3 12.8,54 12,54.8 12,67.2 8.2,71 5.19,71 SV1.3
N$54  (via drill 0.4)
  Top 0.4: U$2.5 72.55,18.65 v72.6,18.6 | IC6.8 82.3,22.91 | 82.3,22.91 83.6,21.6 v83.6,19.2 85,19.2 85.8,20 C7.1 | 82.3,22.91 82.3,26.7 R4.P$1
  Bottom 0.4: v72.6,18.6 73,19 76.6,19 77.2,18.4 82.2,18.4 83,19.2 v83.6,19.2
N$55  (via drill 0.4)
  Top 0.4: IC4.1 85.47,49.73 85.4,49.8 79.4,49.8 79.2,49.6 | 79.2,49.6 79.2,33.8 v79.6,33.4 | R6.P$2 R4.P$2 74.8,27 75.2,27.4 v75.2,33.4 74.8,33.4 73.8,32.4 69.8,32.4 69.03,31.64 IC8.3 | v79,49.6 79.2,49.6 | v78.2,52.6 78.2,60.6 80,62.4 80,65.85 R3.1
  Bottom 0.4: v79.6,33.4 v75.2,33.4 | v78.2,52.6 78.2,50.4 v79,49.6
N$56
  Top 0.25: IC11.4 12.5,53.5 11.4,54.6 11.4,66.8 8.6,69.6 6.33,69.6 SV1.4
N$57
  Top 0.25: IC11.5 12.21,52.99 10.8,54.4 10.8,66.4 9,68.2 4.8,68.2 4,67.4 4,67.27 SV1.5
N$58
  Top 0.25: IC11.6 11.89,52.51 10.2,54.2 10.2,66.2 9.4,67 SV1.6
N$59
  Top 0.25: IC11.7 11.6,52 9.6,54 9.6,65.2 9,65.8 5.07,65.8 SV1.7
N$60
  Top 0.25: IC11.8 11.31,51.49 9,53.8 9,64.2 8.8,64.4 6.33,64.4 SV1.8
N$61
  Top 0.2: IC11.12 13.11,49.51 13,49.4 9.6,49.4 5.4,53.6 X4.1
N$62
  Top 0.2: IC11.15 13.41,48.01 13.2,47.8 13.2,47.2 13,47 8.6,47 4.4,51.2 3.53,51.2 X4.2
N$63
  Top 0.4: IC3.6 84.97,75.64 85.4,75.2 85.4,71.4 85,71 84.85,71 | 84.85,71 84.75,71 | 84.85,71 R2.2 84.75,71 | D1.A 83.6,70.4 84.2,71 84.75,71
N$64
  Top 0.4: D1.K 79.78,69.17 R3.2
N$65  (via drill 0.4)
  Top 0.4: U$1.8 87.65,9.85 87.8,10 v87.8,14.6 | v87.8,16.6 86.4,16.6 86.12,16.32 U$1.2
  Bottom 0.4: v87.8,14.6 v87.8,16.6
N$66
  Top 0.4: IC9.6 57.56,22.64 57.2,23 50.8,23 49.8,22 49.8,21.12 U$3.5 U$3.6 U$3.7 U$3.8
N$67
  Top 0.16: U$2.3 U$2.2
N$68  (via drill 3.2 pad 6)
  other vias: 90,35
N$69
  Top 0.4: R1.1 79.8,78.2 80.4,78.8 84.8,78.8 | 84.8,78.8 85.6,78.8 86.4,78 86.4,75.2 87.23,74.36 IC3.2 | X3.2 84.67,78.93 84.8,78.8
N$70
  pour Bottom: 82,58 82,43 95,43 95,58
N$71
  pour Top: 82,58 82,43 95,43 95,58
SW_ID  (via drill 0.4)
  Top 0.2: IC5.16 74.93,3.53 v74.8,3.4 | v42,32.6 42,35.2 41.8,35.4 41.8,46.6 40.4,48 R11.2
  Bottom 0.2: v74.8,3.4 72.8,3.4 72.6,3.2 38.8,3.2 36,6 36,15.6 42,21.6 v42,32.6
SW_IIN  (via drill 0.4)
  Top 0.2: IC5.1 81.07,3.27 v81,3.2 | v41,32.6 41,35 41.4,35.4 41.4,45 40.4,46 R10.2
  Bottom 0.2: v81,3.2 76.2,3.2 75.6,2.6 72.8,2.6 72.6,2.8 38.6,2.8 35.6,5.8 35.6,15.8 41,21.2 v41,32.6
SW_IR+  (via drill 0.4)
  Top 0.2: IC5.8 83.16,13.45 v83.4,13.2 | v40,32.6 40,35.2 41,36.2 41,43.4 40.4,44 R9.2
  Bottom 0.2: v83.4,13.2 83.4,12.6 85.2,10.8 85.2,4.6 83,2.4 76,2.4 75.8,2.2 72.6,2.2 72.4,2.4 38.4,2.4 35.2,5.6 35.2,16 40,20.8 v40,32.6
SW_IR-  (via drill 0.4)
  Top 0.2: IC5.9 73.64,13.45 73.4,13.2 v71.8,13.2 | v43,32.6 43,34.8 42.2,35.8 42.2,48 40.2,50 R12.2
  Bottom 0.2: v71.8,13.2 71.2,12.6 71.2,4.4 70.4,3.6 39,3.6 36.4,6.2 36.4,15.4 43,22 v43,32.6
SW_VRH  (via drill 0.4)
  Top 0.2: IC6.6 81.97,20.36 v82.8,21.2 | v39,32.6 39,35 40.6,36.6 40.6,41.6 40.2,42 R8.2
  Bottom 0.2: v82.8,21.2 83,21.4 87.4,21.4 89,19.8 89,7.8 83.2,2 76.2,2 76,1.8 72.4,1.8 72.2,2 38.2,2 34.8,5.4 34.8,16.2 39,20.4 v39,32.6
VREF+  (via drill 0.4)
  Top 0.4: v56.4,22 54.8,22 54.35,21.55 U$3.4 U$3.3 | v66.4,21.4 66.4,20.2 66.2,20 64.69,20 IC9.1 | IC9.2 IC9.1 | U$1.4 84.83,16.18 84.2,16.8 v82.15,16.8 | v75.4,16.8 66.4,16.8 64.6,18.6 IC9.1
  Bottom 0.4: v56.4,22 65.8,22 v66.4,21.4 | v82.15,16.8 v75.4,16.8
VREF-  (via drill 0.4)
  Top 0.4: U$1.3 85.47,16.73 84.4,17.8 v82.85,17.8 | v76.4,17.8 67,17.8 v66,18.8 | IC9.7 57.16,21.36 56.4,20.6 56.4,19 | U$3.2 U$3.1 55.58,19.02 55.6,19 56.4,19 | v59,18.8 58.8,18.8 58.6,19 56.4,19
  Bottom 0.4: v82.85,17.8 v76.4,17.8 | v66,18.8 v59,18.8